# Altium schematic sheet POWER.SchDoc
size A4; Address1: 00-<Schema Name>; DocumentNumber: 3; SheetNumber: 3; SheetTotal: 5; ModifiedBy: -; Size: A4
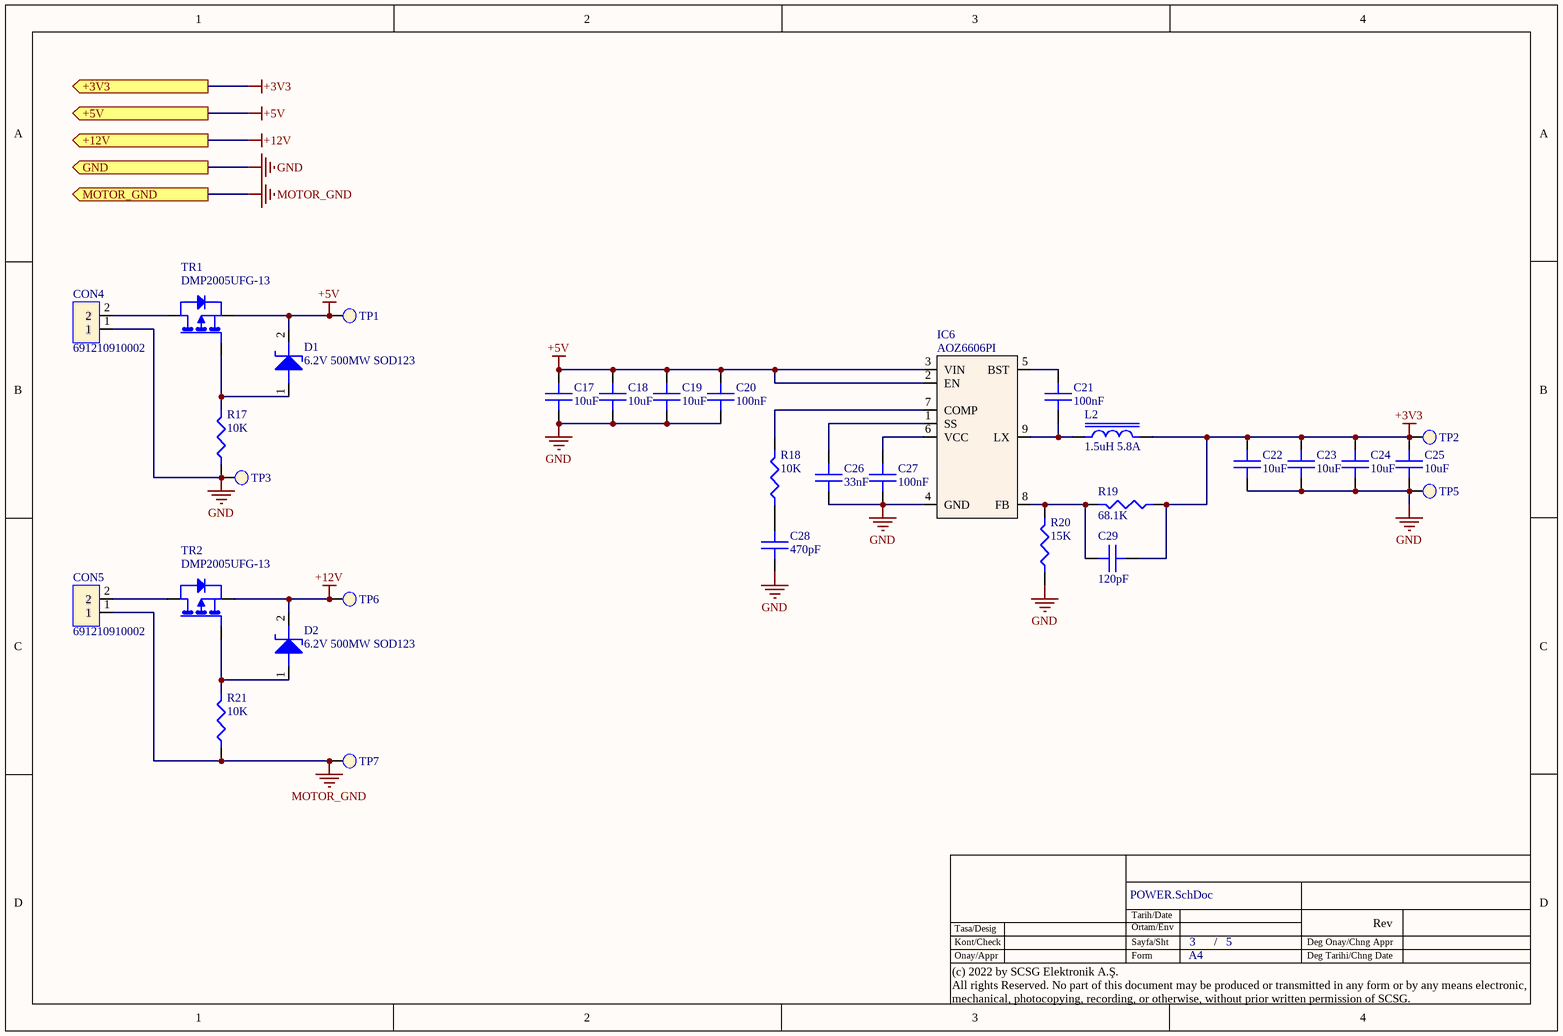
[diagram p0: POWER.SchDoc]

## Parts
C17  10uF  [C0805]
C18  10uF  [C0805]
C19  10uF  [C0805]
C20  100nF  [C0402]
C21  100nF  [C0402]
C22  10uF  [C0805]
C23  10uF  [C0805]
C24  10uF  [C0805]
C25  10uF  [C0805]
C26  33nF  [C0402]
C27  100nF  [C0402]
C28  470pF  [C0402]
C29  120pF  [C0402]
CON4  691210910002  [691210910002]
CON5  691210910002  [691210910002]
D1  6.2V 500MW SOD123  [SOD123]
D2  6.2V 500MW SOD123  [SOD123]
IC6  AOZ6606PI  [SO08 - EP1]
L2  1.5uH 5.8A  [WE-MAPI_4020]
R17  10K  [R0402]
R18  10K  [R0402]
R19  68.1K  [R0402]
R20  15K  [R0402]
R21  10K  [R0402]
TP1  TestPoint1  [SMD_1mmPoint]  (value not drawn)  (no BOM)
TP2  TestPoint1  [SMD_1mmPoint]  (value not drawn)  (no BOM)
TP3  TestPoint1  [SMD_1mmPoint]  (value not drawn)  (no BOM)
TP5  TestPoint1  [SMD_1mmPoint]  (value not drawn)  (no BOM)
TP6  TestPoint1  [SMD_1mmPoint]  (value not drawn)  (no BOM)
TP7  TestPoint1  [SMD_1mmPoint]  (value not drawn)  (no BOM)
TR1  DMP2005UFG-13  [PowerDI3333-8]
TR2  DMP2005UFG-13  [PowerDI3333-8]

## Ports
+3V3 (out), +5V (out), +12V (out), GND (out), MOTOR_GND (out)

## Nets
+3V3: C22.2 C23.2 C24.2 C25.2 C29.2 L2.2 R19.1 TP2.1 ; port +3V3
+5V: C17.2 C18.2 C19.2 C20.2 D1.2(K) IC6.2(EN) IC6.3(VIN) TP1.1 TR1.1(S) ; port +5V
+12V: D2.2(K) TP6.1 TR2.1(S) ; port +12V
GND: C17.1 C18.1 C19.1 C20.1 C22.1 C23.1 C24.1 C25.1 C26.1 C27.1 C28.1 CON4.1 IC6.4(GND) R17.1 R20.1 TP3.1 TP5.1 ; port GND
MOTOR_GND: CON5.1 R21.1 TP7.1 ; port MOTOR_GND
NetC21_1: C21.1 IC6.5(BST)
NetC21_2: C21.2 IC6.9(LX) L2.1
NetC26_2: C26.2 IC6.1(SS)
NetC27_2: C27.2 IC6.6(VCC)
NetC28_2: C28.2 R18.1
NetC29_1: C29.1 IC6.8(FB) R19.2 R20.2
NetCON4_2: CON4.2 TR1.3(D)
NetCON5_2: CON5.2 TR2.3(D)
NetD1_1: D1.1(A) R17.2 TR1.2(G)
NetD2_1: D2.1(A) R21.2 TR2.2(G)
NetIC6_7: IC6.7(COMP) R18.2

## Notes on the sheet
- Tarih/Date
- Tasa/Desig
- Kont/Check
- Onay/Appr
- Sayfa/Sht
- Form
- Ortam/Env
- A4
- /
- Deg Tarihi/Chng Date
- Deg Onay/Chng Appr
- Rev
- (c) 2022 by SCSG Elektronik A.Ş.
  All rights Reserved. No part of this document may be produced or transmitted in any form or by any means electronic, mechanical, photocopying, recording, or otherwise, without prior written permission of SCSG.

## Library data of the parts
C17-C19 C22-C25 = CC0805KFX7R6BB106: 10uF ,10V ,X7R ,0805; Manufacturer: Yageo; Value: 10000000; Dielectric Material: Ceramic; Tolerance: 10%; Purpose Of Usage: BASIC; Supplier 1: Digi-Key; Manufacturer Part Number: CC0805KFX7R6BB106; RoHS: YES; Supplier Part Number 1: 13-CC0805KFX7R6BB106CT-ND; Category: CAPASITOR; Sub-Category: CERAMIC; Case/Package: 0805; Case Code (Imperial): 0805; Case Code (Metric): 2012; Dielectric: X7R; Max Operating Temperature: 125°C; Min Operating Temperature: -55°C; Mount: SMD; Stock ID: ??; Voltage Rating (DC): 10V; Voltage Rating: 10V; Local Supplier: GENERAL; Price 10K: 0.00250
C20 C21 C27 = CC0402KRX7R6BB104: 100nF ,10V ,X7R ,0402; Manufacturer: Yageo; Value: 100000; Tolerance: 10%; Dielectric Material: Ceramic; Purpose Of Usage: BASIC; Supplier 1: Digi-Key; Manufacturer Part Number: CC0402KRX7R6BB104; RoHS: YES; Category: CAPASITOR; Mount: SMD; Case/Package: 0402; Case Code (Imperial): 0402; Case Code (Metric): 1005; Min Operating Temperature: -55°C; Max Operating Temperature: 125°C; Voltage Rating: 10V; Voltage Rating (DC): 10V; Dielectric: X7R; Height: 0.5mm; Supplier Part Number 1: 311-1345-1-ND; Sub-Category: CERAMIC; Stock ID: ??; Local Supplier: GENERAL; Price 10K: 0.00250
C26 = CC0402KRX7R9BB333: 33nF, 50V, X7R, 0402; Manufacturer: Yageo; Value: 33000; Temperature Coefficient: 30ppm/°C; Dielectric Material: Ceramic; Purpose Of Usage: BASIC; Tolerance: 10%; Manufacturer Part Number: CC0402KRX7R9BB333; RoHS: YES; Category: CAPASITOR; Case/Package: 0402; Min Operating Temperature: -55°C; Max Operating Temperature: 125°C; Dielectric: X7R; Voltage Rating: 50V; Voltage Rating (DC): 50V; Height: 0.5mm; Case Code (Imperial): 0402; Case Code (Metric): 1005; Local Supplier: GENERAL; Mount: SMD; Price 10K: 0.00250; Stock ID: ??; Sub-Category: CERAMIC; Supplier 1: Digi-Key; Supplier Part Number 1: 13-CC0402KRX7R9BB333CT-ND
C28 = CC0402JRNPO9BN471: 470pF, 50V, NP0, 0402; Manufacturer: Yageo; Tolerance: 5%; Value: 470; Dielectric: C0G; Dielectric Material: Ceramic; Purpose Of Usage: BASIC; Supplier 1: Digi-Key; Manufacturer Part Number: CC0402JRNPO9BN471; RoHS: YES; Category: CAPASITOR; Case/Package: 0402; Case Code (Imperial): 0402; Case Code (Metric): 1005; Min Operating Temperature: -55°C; Max Operating Temperature: 125°C; Voltage Rating (DC): 50V; Voltage Rating: 50V; Supplier Part Number 1: 311-1671-2-ND; Height: 0.5mm; Local Supplier: GENERAL; Mount: SMD; Price 10K: 0.00250; Stock ID: ??; Sub-Category: CERAMIC
C29 = CC0402JRNPO9BN121: 120pF, 50V, NP0, 0402; Manufacturer: Yageo; Tolerance: 5%; Value: 120; Dielectric: C0G; Dielectric Material: Ceramic; Purpose Of Usage: BASIC; Supplier 1: Digi-Key; Manufacturer Part Number: CC0402JRNPO9BN121; RoHS: YES; Category: CAPASITOR; Mount: SMD; Case/Package: 0402; Case Code (Imperial): 0402; Case Code (Metric): 1005; Min Operating Temperature: -55°C; Max Operating Temperature: 125°C; Voltage Rating: 50V; Voltage Rating (DC): 50V; Height: 0.5mm; Supplier Part Number 1: 311-3337-1-ND; Sub-Category: CERAMIC; Stock ID: ??; Local Supplier: GENERAL; Price 10K: 0.00250
CON4 CON5 = 691210910002: 2.54 Mm Terminal Block, Horizont; Manufacturer: Wurth Electronics; Purpose Of Usage: BASIC; Supplier 1: Digi-Key; Supplier Part Number 1: 732-691210910002-ND; Manufacturer Part Number: 691210910002; RoHS: No; Category: CONNECTORS; Sub-Category: TERMINAL BLOCK; Stock ID: ??
D1 D2 = MMSZ5234B-7-F: DIODE ZENER 6.2V 500MW SOD123; Manufacturer: Diodes; Element Configuration: Single; Purpose Of Usage: BASIC; Supplier 1: Digi-Key; Supplier Part Number 1: MMSZ5234B-FDICT-ND; Manufacturer Part Number: MMSZ5234B-7-F; RoHS: YES; Mount: SMD; Case/Package: SOD-123-2; Min Operating Temperature: -65°C; Max Operating Temperature: 150°C; Category: DIODE; Sub-Category: ZENER; Stock ID: ??
IC6 = AOZ6606PI: Switching Regulator, Current-mode, 6A, 650kHz Switching Freq-Max, PDSO8; Manufacturer: Alpha & Omega Semiconductor; Max Supply Voltage: 15.3V; Min Supply Voltage: 4.5V; Purpose Of Usage: BASIC; Topology: BUCK; Manufacturer Part Number: AOZ6606PI; RoHS: Yes; Category: INTEGRATED CIRCUITS; Case/Package: SO-08 EP; Lead Free: Lead Free; Max Operating Temperature: 85°C; Min Operating Temperature: -40°C; Mount: SMD; Stock ID: ??; Sub-Category: PMIC - DC/DC Switching Regulator; Supplier 1: Digi-Key; Supplier Part Number 1: 785-1854-1-ND
L2 = 74438356015: Fixed Ind 1.5UH 5.8A 19 Mohm SMD; Manufacturer: Wurth Electronics; Saturation Current: 7.8A; Shielding: Shielded; DC Resistance (DCR): 19mR; Self Resonant Frequency: 48MHz; Test Frequency: 100kHz; Tolerance: 20%; Purpose Of Usage: BASIC; Manufacturer Part Number: 74438356015; RoHS: YES; Category: INDUCTORS; Case/Package: Nonstandard; Min Operating Temperature: -40°C; Max Operating Temperature: 125°C; Value: 1.5uH; Current Rating: 5.8A; RMS Current (Irms): 5.8A; Inductance Tolerance: 20%; Series: WE-MAPI; Length: 0.161inch; RoHS Compliant: Yes; Mount: SMD; Stock ID: ??; Sub-Category: FIXED INDUCTORS; Supplier 1: Digi-Key; Supplier Part Number 1: 732-8230-1-ND
R17 R18 R21 = RC0402FR-0710KL: 10K, %1, 1/16W, 0402; Manufacturer: YAGEO; Voltage Rating: 50V; Value: 10000; Power Rating: 63mW; Tolerance: 1%; Temperature Coefficient: 100ppm/°C; Purpose Of Usage: BASIC; Supplier 1: Digi-Key; Manufacturer Part Number: RC0402FR-0710KL; RoHS: YES; Category: RESISTOR; Case/Package: 0402; Case Code (Imperial): 0402; Min Operating Temperature: -55°C; Max Operating Temperature: 155°C; Max Power Dissipation: 63mW; Voltage Rating (DC): 50V; Working Voltage: 50V; Supplier Part Number 1: 311-10.0KLRCT-ND; Stock ID: ??; Mount: SMD; Sub-Category: CHIP RESISTOR; Price 10K: 0.0025; Local Supplier: GENERAL
R19 = RC0402FR-0768K1L: 68.1K, %1, 1/16W, 0402; Manufacturer: YAGEO; Voltage Rating (DC): 50V; Max Power Dissipation: 63mW; Power Rating: 62.5mW; Purpose Of Usage: BASIC; Temperature Coefficient: 100ppm/°C; Tolerance: 1%; Value: 68100; Manufacturer Part Number: RC0402FR-0768K1L; RoHS: YES; Category: RESISTOR; Case/Package: 0402; Case Code (Imperial): 0402; Local Supplier: GENERAL; Max Operating Temperature: 155°C; Min Operating Temperature: -55°C; Mount: SMD; Price 10K: 0.0025; Stock ID: ??; Sub-Category: CHIP RESISTOR; Supplier 1: Digi-Key; Supplier Part Number 1: YAG3213CT-ND; Voltage Rating: 50V
R20 = RC0402FR-0715KL: 15K, %1, 1/16W, 0402; Manufacturer: YAGEO; Tolerance: 1%; Power Rating: 62.5mW; Value: 15000; Voltage Rating: 50V; Temperature Coefficient: 100ppm/°C; Max Power Dissipation: 63mW; Purpose Of Usage: BASIC; Manufacturer Part Number: RC0402FR-0715KL; RoHS: Yes; Category: RESISTOR; Case/Package: 0402; Case Code (Imperial): 0402; Min Operating Temperature: -55°C; Max Operating Temperature: 155°C; Voltage Rating (DC): 50V; Local Supplier: GENERAL; Mount: SMD; Price 10K: 0.0025; Stock ID: ??; Sub-Category: CHIP RESISTOR; Supplier 1: Digi-Key; Supplier Part Number 1: 311-15.0KLRCT-ND
TP1-TP3 TP5-TP7 = TestPoint1: test ölçüm noktası; Manufacturer: NO BOM DEVICE; Purpose Of Usage: BASIC; Category: CONNECTORS; Sub-Category: TEST POINT; Manufacturer Part Number: NO BOM DEVICE; Stock ID: ??
TR1 TR2 = DMP2005UFG-13: 20V P-channel Enhancement Mode Mosfet, 20V Vds, 10±V Vgs; Manufacturer: Diodes; Max Power Dissipation: 2.2W; Purpose Of Usage: BASIC; Manufacturer Part Number: DMP2005UFG-13; RoHS: Yes; Category: MOSFETs; Min Operating Temperature: -55°C; Max Operating Temperature: 150°C; Case/Package: DI3333-8; Mount: SMD; Polarity: P-CHANNEL; Stock ID: ??; Sub-Category: P-CHANNEL; Supplier 1: Digi-Key; Supplier Part Number 1: 31-DMP2005UFG-13CT-ND